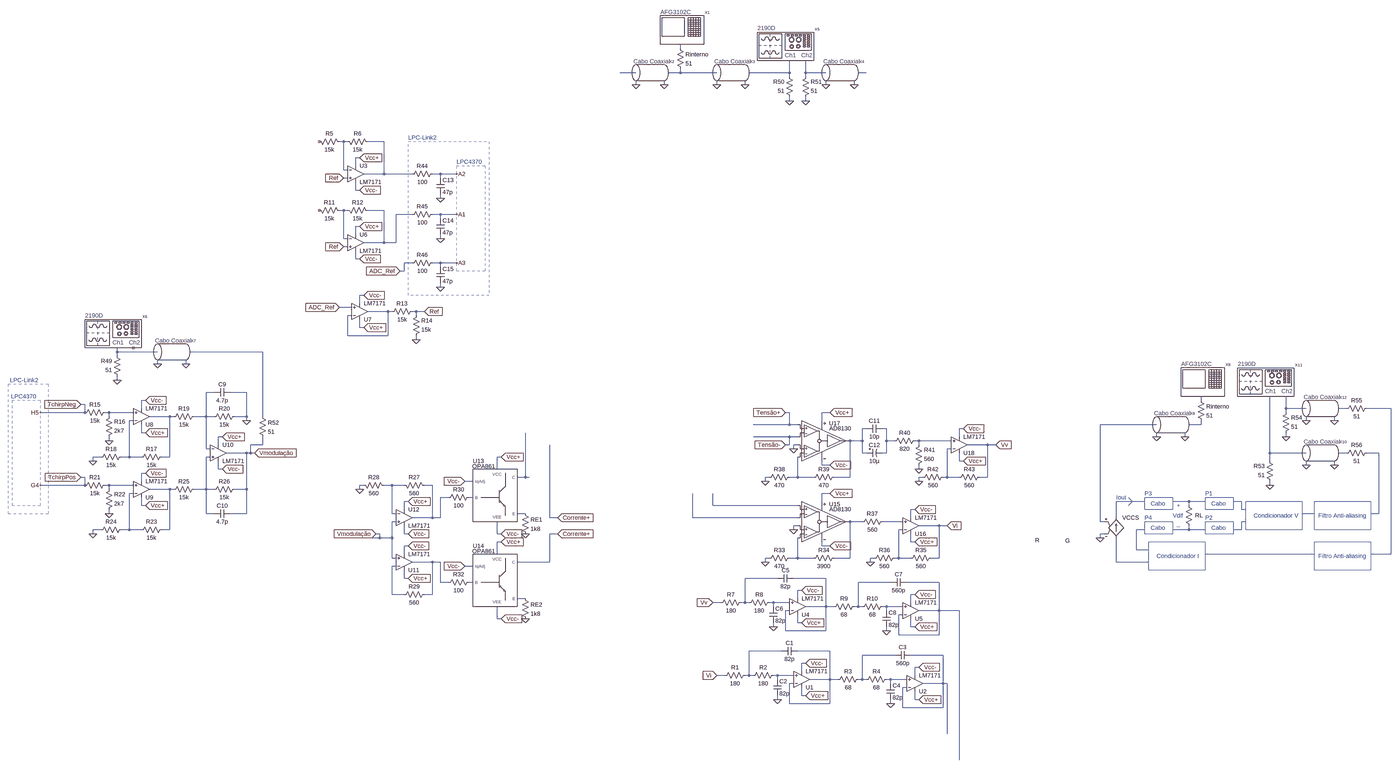
[diagram p0: schematic Circuitos de teste-atraso de grupo.asc, whole sheet]
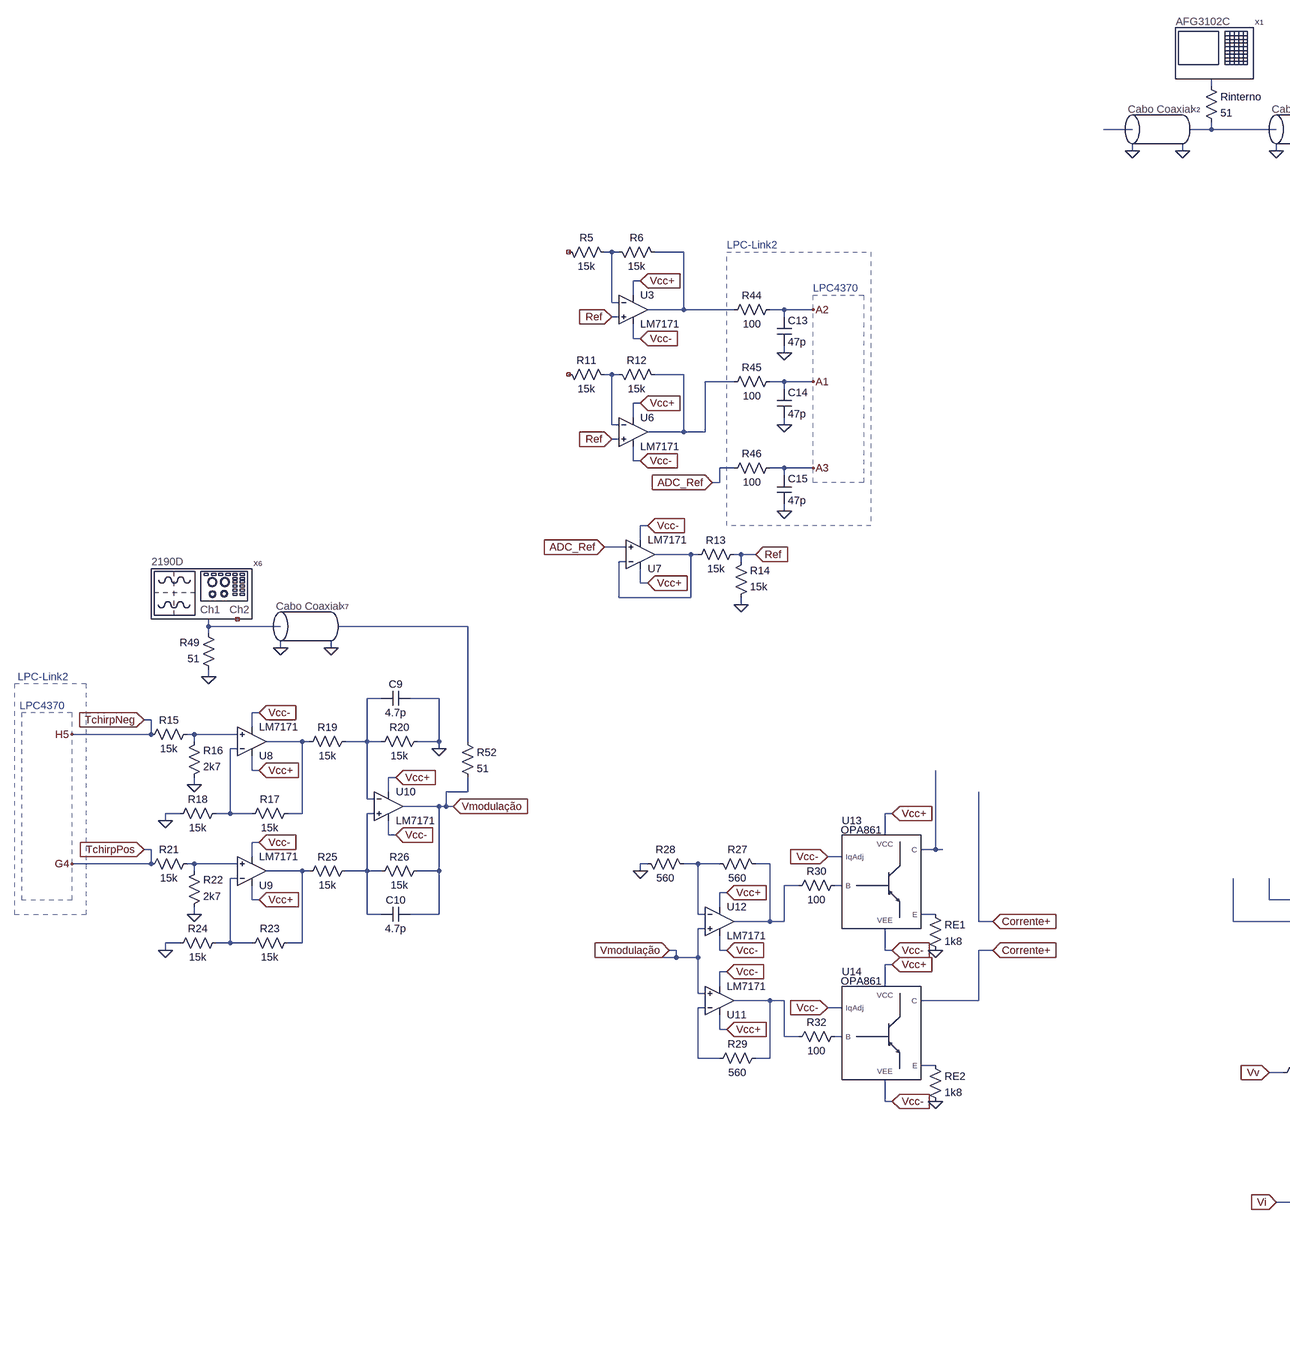
[diagram p1: schematic Circuitos de teste-atraso de grupo.asc, part, row 1 of 1, column 1 of 2]
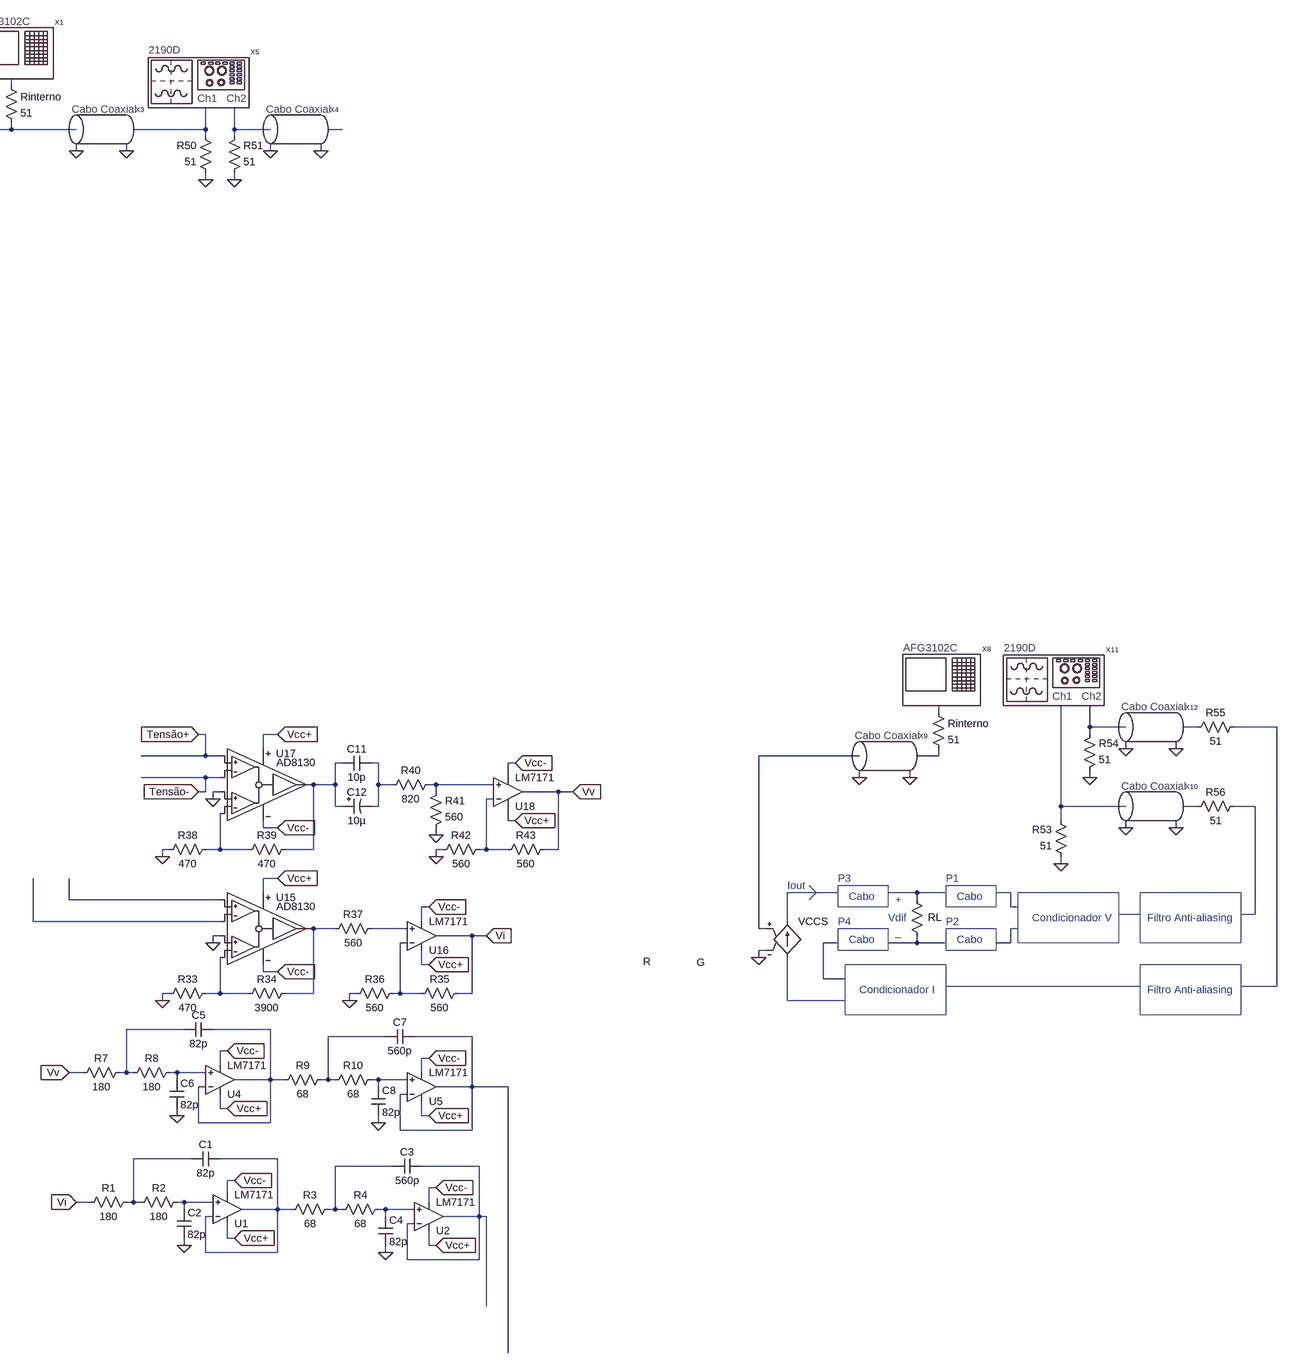
[diagram p2: schematic Circuitos de teste-atraso de grupo.asc, part, row 1 of 1, column 2 of 2]
Circuitos de teste-atraso de grupo.asc, the LTspice schematic file:
Version 4
SHEET 1 1948 1940
WIRE -1024 -1664 -1024 -1680
WIRE -1200 -1568 -1264 -1568
WIRE -1024 -1568 -1024 -1584
WIRE -1024 -1568 -1072 -1568
WIRE -880 -1568 -1024 -1568
WIRE -592 -1568 -592 -1616
WIRE -592 -1568 -752 -1568
WIRE -528 -1568 -528 -1616
WIRE -448 -1568 -528 -1568
WIRE -288 -1568 -320 -1568
WIRE -592 -1552 -592 -1568
WIRE -528 -1552 -528 -1568
WIRE -1200 -1520 -1200 -1536
WIRE -1088 -1520 -1088 -1536
WIRE -880 -1520 -880 -1536
WIRE -768 -1520 -768 -1536
WIRE -448 -1520 -448 -1536
WIRE -336 -1520 -336 -1536
WIRE -592 -1456 -592 -1472
WIRE -528 -1456 -528 -1472
WIRE -3536 -880 -3552 -880
WIRE -3520 -880 -3536 -880
WIRE -3376 -880 -3440 -880
WIRE -3472 -816 -3488 -816
WIRE -3488 -784 -3488 -816
WIRE -3536 -768 -3536 -880
WIRE -3520 -768 -3536 -768
WIRE -3376 -752 -3376 -880
WIRE -3376 -752 -3456 -752
WIRE -3264 -752 -3376 -752
WIRE -3152 -752 -3184 -752
WIRE -3088 -752 -3152 -752
WIRE -3520 -736 -3536 -736
WIRE -3152 -736 -3152 -752
WIRE -3488 -688 -3488 -720
WIRE -3472 -688 -3488 -688
WIRE -3152 -656 -3152 -672
WIRE -3536 -608 -3552 -608
WIRE -3520 -608 -3536 -608
WIRE -3376 -608 -3440 -608
WIRE -3264 -592 -3328 -592
WIRE -3152 -592 -3184 -592
WIRE -3088 -592 -3152 -592
WIRE -3152 -576 -3152 -592
WIRE -3472 -544 -3488 -544
WIRE -3488 -512 -3488 -544
WIRE -3536 -496 -3536 -608
WIRE -3520 -496 -3536 -496
WIRE -3152 -496 -3152 -512
WIRE -3376 -480 -3376 -608
WIRE -3376 -480 -3456 -480
WIRE -3328 -480 -3328 -592
WIRE -3328 -480 -3376 -480
WIRE -3520 -464 -3536 -464
WIRE -3488 -416 -3488 -448
WIRE -3472 -416 -3488 -416
WIRE -3264 -400 -3296 -400
WIRE -3152 -400 -3184 -400
WIRE -3088 -400 -3152 -400
WIRE -3152 -384 -3152 -400
WIRE -3296 -368 -3296 -400
WIRE -3296 -368 -3312 -368
WIRE -3152 -304 -3152 -320
WIRE -3456 -272 -3472 -272
WIRE -3472 -240 -3472 -272
WIRE -3504 -224 -3552 -224
WIRE -3360 -208 -3440 -208
WIRE -3344 -208 -3360 -208
WIRE -3248 -208 -3264 -208
WIRE -3216 -208 -3248 -208
WIRE -3504 -192 -3520 -192
WIRE -3248 -192 -3248 -208
WIRE -3472 -144 -3472 -176
WIRE -3456 -144 -3472 -144
WIRE -3520 -112 -3520 -192
WIRE -3360 -112 -3360 -208
WIRE -3360 -112 -3520 -112
WIRE -3248 -96 -3248 -112
WIRE -4432 -48 -4432 -64
WIRE -4272 -48 -4432 -48
WIRE -3856 -48 -4144 -48
WIRE -4432 -32 -4432 -48
WIRE -4272 0 -4272 -16
WIRE -4160 0 -4160 -16
WIRE -4432 64 -4432 48
WIRE -4048 112 -4080 112
WIRE -3920 112 -3984 112
WIRE -4320 144 -4336 144
WIRE 1104 144 1104 128
WIRE -4560 160 -4576 160
WIRE -4336 176 -4336 144
WIRE 1440 176 1440 128
WIRE 1520 176 1440 176
WIRE 1680 176 1648 176
WIRE 1856 176 1760 176
WIRE -4560 192 -4560 160
WIRE -4560 192 -4736 192
WIRE -4464 192 -4480 192
WIRE -4368 192 -4464 192
WIRE -592 192 -608 192
WIRE -432 192 -464 192
WIRE 1440 192 1440 176
WIRE -4464 208 -4464 192
WIRE -4224 208 -4304 208
WIRE -4208 208 -4224 208
WIRE -4080 208 -4080 112
WIRE -4080 208 -4128 208
WIRE -4048 208 -4080 208
WIRE -3920 208 -3920 112
WIRE -3920 208 -3968 208
WIRE -3856 208 -3856 -48
WIRE -4368 224 -4384 224
WIRE -3920 224 -3920 208
WIRE -464 224 -464 192
WIRE 1520 224 1520 208
WIRE 1632 224 1632 208
WIRE -592 240 -592 192
WIRE -592 240 -736 240
WIRE -560 240 -592 240
WIRE 928 240 704 240
WIRE 1104 240 1104 224
WIRE 1104 240 1056 240
WIRE -288 256 -304 256
WIRE -208 256 -224 256
WIRE 96 256 80 256
WIRE -4336 272 -4336 240
WIRE -4320 272 -4336 272
WIRE -4016 288 -4032 288
WIRE -592 288 -736 288
WIRE -560 288 -592 288
WIRE 80 288 80 256
WIRE 928 288 928 272
WIRE 1040 288 1040 272
WIRE 1440 288 1440 272
WIRE -4464 304 -4464 288
WIRE -304 304 -304 256
WIRE -304 304 -352 304
WIRE -208 304 -208 256
WIRE -176 304 -208 304
WIRE -80 304 -96 304
WIRE 48 304 -80 304
WIRE -4032 320 -4032 288
WIRE -3856 320 -3856 288
WIRE -3856 320 -3904 320
WIRE -592 320 -592 288
WIRE -592 320 -608 320
WIRE -560 320 -576 320
WIRE -80 320 -80 304
WIRE 192 320 112 320
WIRE 224 320 192 320
WIRE -4080 336 -4080 208
WIRE -4064 336 -4080 336
WIRE -576 336 -576 320
WIRE 48 336 32 336
WIRE -3920 352 -4000 352
WIRE -3904 352 -3904 320
WIRE -3904 352 -3920 352
WIRE -3888 352 -3904 352
WIRE -304 352 -304 304
WIRE -288 352 -304 352
WIRE -208 352 -208 304
WIRE -208 352 -224 352
WIRE 1376 352 1376 128
WIRE 1520 352 1376 352
WIRE 1680 352 1648 352
WIRE 1808 352 1760 352
WIRE -4496 368 -4528 368
WIRE -4384 368 -4384 224
WIRE -4384 368 -4416 368
WIRE -4336 368 -4384 368
WIRE -4224 368 -4224 208
WIRE -4224 368 -4256 368
WIRE -4064 368 -4080 368
WIRE -2912 368 -2928 368
WIRE -4528 384 -4528 368
WIRE 80 384 80 352
WIRE 96 384 80 384
WIRE 1376 384 1376 352
WIRE -464 400 -464 384
WIRE -432 400 -464 400
WIRE 1520 400 1520 384
WIRE 1632 400 1632 384
WIRE -4032 416 -4032 384
WIRE -4016 416 -4032 416
WIRE -2928 416 -2928 368
WIRE -80 416 -80 400
WIRE -4320 432 -4336 432
WIRE -4560 448 -4576 448
WIRE -2816 448 -2816 272
WIRE -2816 448 -2848 448
WIRE -2800 448 -2816 448
WIRE -672 448 -688 448
WIRE -560 448 -560 368
WIRE -560 448 -592 448
WIRE -496 448 -560 448
WIRE -352 448 -352 304
WIRE -352 448 -416 448
WIRE -64 448 -80 448
WIRE 32 448 32 336
WIRE 32 448 16 448
WIRE 80 448 32 448
WIRE 192 448 192 320
WIRE 192 448 160 448
WIRE -4336 464 -4336 432
WIRE -3024 464 -3056 464
WIRE -688 464 -688 448
WIRE -80 464 -80 448
WIRE -4560 480 -4560 448
WIRE -4560 480 -4736 480
WIRE -4464 480 -4480 480
WIRE -4368 480 -4464 480
WIRE -3456 480 -3472 480
WIRE -3344 480 -3376 480
WIRE -3296 480 -3344 480
WIRE -3184 480 -3216 480
WIRE 1376 480 1376 464
WIRE -4464 496 -4464 480
WIRE -4224 496 -4304 496
WIRE -4208 496 -4224 496
WIRE -4080 496 -4080 368
WIRE -4080 496 -4128 496
WIRE -4048 496 -4080 496
WIRE -3920 496 -3920 352
WIRE -3920 496 -3968 496
WIRE -3472 496 -3472 480
WIRE -4368 512 -4384 512
WIRE -432 512 -464 512
WIRE -3120 528 -3152 528
WIRE -3024 528 -3040 528
WIRE -3280 544 -3296 544
WIRE -464 544 -464 512
WIRE 880 544 768 544
WIRE 1056 544 992 544
WIRE 1120 544 1056 544
WIRE 1264 544 1232 544
WIRE -4336 560 -4336 528
WIRE -4320 560 -4336 560
WIRE -896 560 -896 512
WIRE -560 560 -896 560
WIRE 1056 560 1056 544
WIRE -3296 576 -3296 544
WIRE -96 576 -112 576
WIRE 1264 576 1264 544
WIRE 1280 576 1264 576
WIRE -4464 592 -4464 576
WIRE -4080 592 -4080 496
WIRE -4048 592 -4080 592
WIRE -3920 592 -3920 496
WIRE -3920 592 -3984 592
WIRE -3344 592 -3344 480
WIRE -3328 592 -3344 592
WIRE -2816 592 -2848 592
WIRE 1552 592 1504 592
WIRE 1808 592 1808 352
WIRE 1808 592 1776 592
WIRE -3184 608 -3184 480
WIRE -3184 608 -3264 608
WIRE -3152 608 -3152 528
WIRE -3152 608 -3184 608
WIRE -2720 608 -2720 320
WIRE -2688 608 -2720 608
WIRE -976 608 -976 512
WIRE -560 608 -976 608
WIRE -112 608 -112 576
WIRE 768 608 768 544
WIRE -3328 624 -3344 624
WIRE -304 624 -352 624
WIRE -144 624 -224 624
WIRE 704 624 704 240
WIRE 720 624 704 624
WIRE 1280 624 1264 624
WIRE -560 640 -576 640
WIRE 0 640 -80 640
WIRE 32 640 0 640
WIRE -4496 656 -4528 656
WIRE -4384 656 -4384 512
WIRE -4384 656 -4416 656
WIRE -4336 656 -4384 656
WIRE -4224 656 -4224 496
WIRE -4224 656 -4256 656
WIRE -576 656 -576 640
WIRE -144 656 -160 656
WIRE 880 656 848 656
WIRE 1056 656 1056 640
WIRE 1056 656 992 656
WIRE 1120 656 1056 656
WIRE 1264 656 1264 624
WIRE 1264 656 1232 656
WIRE -4528 672 -4528 656
WIRE -3392 672 -3408 672
WIRE -3296 672 -3296 640
WIRE -3280 672 -3296 672
WIRE -2928 672 -2928 624
WIRE -2912 672 -2928 672
WIRE -2688 672 -2720 672
WIRE 720 672 704 672
WIRE -3392 688 -3392 672
WIRE -3392 688 -3552 688
WIRE -3344 688 -3344 624
WIRE -3344 688 -3392 688
WIRE 704 688 704 672
WIRE -2912 704 -2928 704
WIRE -112 704 -112 672
WIRE -96 704 -112 704
WIRE -3280 720 -3296 720
WIRE -464 720 -464 704
WIRE -432 720 -464 720
WIRE 848 736 848 656
WIRE 896 736 848 736
WIRE -3296 752 -3296 720
WIRE -2928 752 -2928 704
WIRE 1552 752 1120 752
WIRE 1856 752 1856 176
WIRE 1856 752 1776 752
WIRE -3344 768 -3344 688
WIRE -3328 768 -3344 768
WIRE -672 768 -688 768
WIRE -560 768 -560 688
WIRE -560 768 -592 768
WIRE -496 768 -560 768
WIRE -352 768 -352 624
WIRE -352 768 -416 768
WIRE -256 768 -272 768
WIRE -160 768 -160 656
WIRE -160 768 -176 768
WIRE -112 768 -160 768
WIRE 0 768 0 640
WIRE 0 768 -32 768
WIRE -3184 784 -3264 784
WIRE -3152 784 -3184 784
WIRE -2720 784 -2720 672
WIRE -2720 784 -2848 784
WIRE -688 784 -688 768
WIRE -272 784 -272 768
WIRE 768 784 768 688
WIRE 896 784 768 784
WIRE -3328 800 -3344 800
WIRE -3024 800 -3056 800
WIRE -3296 848 -3296 816
WIRE -3280 848 -3296 848
WIRE -640 848 -768 848
WIRE -448 848 -576 848
WIRE -3152 864 -3152 784
WIRE -3120 864 -3152 864
WIRE -3024 864 -3040 864
WIRE -192 864 -320 864
WIRE 0 864 -128 864
WIRE -544 896 -560 896
WIRE -3344 912 -3344 800
WIRE -3296 912 -3344 912
WIRE -3184 912 -3184 784
WIRE -3184 912 -3216 912
WIRE -96 912 -112 912
WIRE -2816 928 -2848 928
WIRE -560 928 -560 896
WIRE -864 944 -896 944
WIRE -768 944 -768 848
WIRE -768 944 -784 944
WIRE -752 944 -768 944
WIRE -656 944 -672 944
WIRE -592 944 -656 944
WIRE -112 944 -112 912
WIRE -656 960 -656 944
WIRE -448 960 -448 848
WIRE -448 960 -528 960
WIRE -416 960 -448 960
WIRE -320 960 -320 864
WIRE -320 960 -336 960
WIRE -304 960 -320 960
WIRE -208 960 -224 960
WIRE -144 960 -208 960
WIRE -592 976 -608 976
WIRE -208 976 -208 960
WIRE 0 976 0 864
WIRE 0 976 -80 976
WIRE 80 976 0 976
WIRE -144 992 -160 992
WIRE -2928 1008 -2928 960
WIRE -2912 1008 -2928 1008
WIRE -560 1024 -560 992
WIRE -544 1024 -560 1024
WIRE -656 1040 -656 1024
WIRE -112 1040 -112 1008
WIRE -96 1040 -112 1040
WIRE -608 1056 -608 976
WIRE -448 1056 -448 960
WIRE -448 1056 -608 1056
WIRE -208 1056 -208 1040
WIRE -160 1072 -160 992
WIRE 0 1072 0 976
WIRE 0 1072 -160 1072
WIRE -624 1136 -752 1136
WIRE -432 1136 -560 1136
WIRE -176 1152 -304 1152
WIRE 16 1152 -112 1152
WIRE -528 1184 -544 1184
WIRE -80 1200 -96 1200
WIRE -544 1216 -544 1184
WIRE -848 1232 -880 1232
WIRE -752 1232 -752 1136
WIRE -752 1232 -768 1232
WIRE -736 1232 -752 1232
WIRE -640 1232 -656 1232
WIRE -576 1232 -640 1232
WIRE -96 1232 -96 1200
WIRE -640 1248 -640 1232
WIRE -432 1248 -432 1136
WIRE -432 1248 -512 1248
WIRE -400 1248 -432 1248
WIRE -304 1248 -304 1152
WIRE -304 1248 -320 1248
WIRE -288 1248 -304 1248
WIRE -192 1248 -208 1248
WIRE -128 1248 -192 1248
WIRE -576 1264 -592 1264
WIRE -192 1264 -192 1248
WIRE 16 1264 16 1152
WIRE 16 1264 -64 1264
WIRE 32 1264 16 1264
WIRE -128 1280 -144 1280
WIRE -544 1312 -544 1280
WIRE -528 1312 -544 1312
WIRE -640 1328 -640 1312
WIRE -96 1328 -96 1296
WIRE -80 1328 -96 1328
WIRE -592 1344 -592 1264
WIRE -432 1344 -432 1248
WIRE -432 1344 -592 1344
WIRE -192 1344 -192 1328
WIRE -144 1360 -144 1280
WIRE 16 1360 16 1264
WIRE 16 1360 -144 1360
WIRE 32 1616 32 1264
WIRE 80 1792 80 976
FLAG -640 1328 0
FLAG -528 1312 Vcc+
IOPIN -528 1312 In
FLAG -528 1184 Vcc-
IOPIN -528 1184 In
FLAG -192 1344 0
FLAG -80 1328 Vcc+
IOPIN -80 1328 In
FLAG -80 1200 Vcc-
IOPIN -80 1200 In
FLAG -3472 -816 Vcc+
IOPIN -3472 -816 In
FLAG -3472 -688 Vcc-
IOPIN -3472 -688 In
FLAG -656 1040 0
FLAG -544 1024 Vcc+
IOPIN -544 1024 In
FLAG -544 896 Vcc-
IOPIN -544 896 In
FLAG -208 1056 0
FLAG -96 1040 Vcc+
IOPIN -96 1040 In
FLAG -96 912 Vcc-
IOPIN -96 912 In
FLAG -3472 -544 Vcc+
IOPIN -3472 -544 In
FLAG -3472 -416 Vcc-
IOPIN -3472 -416 In
FLAG -3456 -144 Vcc+
IOPIN -3456 -144 In
FLAG -3456 -272 Vcc-
IOPIN -3456 -272 In
FLAG -3248 -96 0
FLAG -3552 -224 ADC_Ref
IOPIN -3552 -224 In
FLAG -3216 -208 Ref
IOPIN -3216 -208 In
FLAG -3536 -464 Ref
IOPIN -3536 -464 In
FLAG -3536 -736 Ref
IOPIN -3536 -736 In
FLAG -4320 272 Vcc+
IOPIN -4320 272 In
FLAG -4320 144 Vcc-
IOPIN -4320 144 In
FLAG -4464 304 0
FLAG -4320 560 Vcc+
IOPIN -4320 560 In
FLAG -4320 432 Vcc-
IOPIN -4320 432 In
FLAG -4464 592 0
FLAG -4016 288 Vcc+
IOPIN -4016 288 In
FLAG -4016 416 Vcc-
IOPIN -4016 416 In
FLAG -3920 224 0
FLAG -4576 160 TchirpNeg
IOPIN -4576 160 In
FLAG -4576 448 TchirpPos
IOPIN -4576 448 In
FLAG -4528 672 0
FLAG -4528 384 0
FLAG -3280 848 Vcc+
IOPIN -3280 848 In
FLAG -3280 720 Vcc-
IOPIN -3280 720 In
FLAG -3280 544 Vcc+
IOPIN -3280 544 In
FLAG -3280 672 Vcc-
IOPIN -3280 672 In
FLAG -3472 496 0
FLAG -2912 672 Vcc-
IOPIN -2912 672 In
FLAG -2912 368 Vcc+
IOPIN -2912 368 In
FLAG -2816 672 0
FLAG -2912 1008 Vcc-
IOPIN -2912 1008 In
FLAG -2912 704 Vcc+
IOPIN -2912 704 In
FLAG -2816 1008 0
FLAG -3056 464 Vcc-
IOPIN -3056 464 In
FLAG -3056 800 Vcc-
IOPIN -3056 800 In
FLAG -576 656 0
FLAG -688 784 0
FLAG -96 704 Vcc+
IOPIN -96 704 In
FLAG -96 576 Vcc-
IOPIN -96 576 In
FLAG -272 784 0
FLAG -432 720 Vcc-
IOPIN -432 720 In
FLAG -432 512 Vcc+
IOPIN -432 512 In
FLAG -576 336 0
FLAG -688 464 0
FLAG 96 384 Vcc+
IOPIN 96 384 In
FLAG 96 256 Vcc-
IOPIN 96 256 In
FLAG -80 464 0
FLAG -432 400 Vcc-
IOPIN -432 400 In
FLAG -432 192 Vcc+
IOPIN -432 192 In
FLAG -608 320 Tensão-
IOPIN -608 320 In
FLAG -608 192 Tensão+
IOPIN -608 192 In
FLAG -80 416 0
FLAG 32 640 Vi
IOPIN 32 640 In
FLAG 224 320 Vv
IOPIN 224 320 In
FLAG -2688 672 Corrente+
IOPIN -2688 672 In
FLAG -2688 608 Corrente+
IOPIN -2688 608 In
FLAG -3152 -656 0
FLAG -3152 -496 0
FLAG -880 1232 Vi
IOPIN -880 1232 In
FLAG -896 944 Vv
IOPIN -896 944 In
FLAG -3152 -304 0
FLAG -3312 -368 ADC_Ref
IOPIN -3312 -368 In
FLAG -3088 -752 A2
FLAG -3088 -592 A1
FLAG -3088 -400 A3
FLAG -3408 672 Vmodulação
IOPIN -3408 672 In
FLAG -3888 352 Vmodulação
IOPIN -3888 352 In
FLAG -4736 192 H5
FLAG -4736 480 G4
FLAG -1200 -1520 0
FLAG -1088 -1520 0
FLAG -880 -1520 0
FLAG -768 -1520 0
FLAG -592 -1456 0
FLAG -528 -1456 0
FLAG -448 -1520 0
FLAG -336 -1520 0
FLAG -4432 64 0
FLAG -4272 0 0
FLAG -4160 0 0
FLAG 928 288 0
FLAG 1040 288 0
FLAG 1376 480 0
FLAG 1440 288 0
FLAG 1520 224 0
FLAG 1632 224 0
FLAG 704 688 0
FLAG 1520 400 0
FLAG 1632 400 0
SYMBOL Opamps\\opamp2 -544 1312 M180
SYMATTR InstName U1
SYMATTR Value LM7171
SYMBOL res -752 1216 R90
WINDOW 0 0 56 VBottom 2
WINDOW 3 32 56 VTop 2
SYMATTR InstName R1
SYMATTR Value 180
SYMBOL res -640 1216 R90
WINDOW 0 0 56 VBottom 2
WINDOW 3 32 56 VTop 2
SYMATTR InstName R2
SYMATTR Value 180
SYMBOL cap -560 1120 R90
WINDOW 0 0 32 VBottom 2
WINDOW 3 32 32 VTop 2
SYMATTR InstName C1
SYMATTR Value 82p
SYMBOL cap -656 1248 R0
SYMATTR InstName C2
SYMATTR Value 82p
SYMBOL Opamps\\opamp2 -96 1328 M180
SYMATTR InstName U2
SYMATTR Value LM7171
SYMBOL res -304 1232 R90
WINDOW 0 0 56 VBottom 2
WINDOW 3 32 56 VTop 2
SYMATTR InstName R3
SYMATTR Value 68
SYMBOL res -192 1232 R90
WINDOW 0 0 56 VBottom 2
WINDOW 3 32 56 VTop 2
SYMATTR InstName R4
SYMATTR Value 68
SYMBOL cap -112 1136 R90
WINDOW 0 0 32 VBottom 2
WINDOW 3 32 32 VTop 2
SYMATTR InstName C3
SYMATTR Value 560p
SYMBOL cap -208 1264 R0
SYMATTR InstName C4
SYMATTR Value 82p
SYMBOL Opamps\\opamp2 -3488 -816 R0
SYMATTR InstName U3
SYMATTR Value LM7171
SYMBOL res -3536 -864 M270
WINDOW 0 32 56 VTop 2
WINDOW 3 0 56 VBottom 2
SYMATTR InstName R5
SYMATTR Value 15k
SYMBOL res -3424 -864 M270
WINDOW 0 32 56 VTop 2
WINDOW 3 0 56 VBottom 2
SYMATTR InstName R6
SYMATTR Value 15k
SYMBOL Opamps\\opamp2 -560 1024 M180
SYMATTR InstName U4
SYMATTR Value LM7171
SYMBOL res -768 928 R90
WINDOW 0 0 56 VBottom 2
WINDOW 3 32 56 VTop 2
SYMATTR InstName R7
SYMATTR Value 180
SYMBOL res -656 928 R90
WINDOW 0 0 56 VBottom 2
WINDOW 3 32 56 VTop 2
SYMATTR InstName R8
SYMATTR Value 180
SYMBOL cap -576 832 R90
WINDOW 0 0 32 VBottom 2
WINDOW 3 32 32 VTop 2
SYMATTR InstName C5
SYMATTR Value 82p
SYMBOL cap -672 960 R0
SYMATTR InstName C6
SYMATTR Value 82p
SYMBOL Opamps\\opamp2 -112 1040 M180
SYMATTR InstName U5
SYMATTR Value LM7171
SYMBOL res -320 944 R90
WINDOW 0 0 56 VBottom 2
WINDOW 3 32 56 VTop 2
SYMATTR InstName R9
SYMATTR Value 68
SYMBOL res -208 944 R90
WINDOW 0 0 56 VBottom 2
WINDOW 3 32 56 VTop 2
SYMATTR InstName R10
SYMATTR Value 68
SYMBOL cap -128 848 R90
WINDOW 0 0 32 VBottom 2
WINDOW 3 32 32 VTop 2
SYMATTR InstName C7
SYMATTR Value 560p
SYMBOL cap -224 976 R0
SYMATTR InstName C8
SYMATTR Value 82p
SYMBOL Opamps\\opamp2 -3488 -544 R0
SYMATTR InstName U6
SYMATTR Value LM7171
SYMBOL res -3536 -592 M270
WINDOW 0 32 56 VTop 2
WINDOW 3 0 56 VBottom 2
SYMATTR InstName R11
SYMATTR Value 15k
SYMBOL res -3424 -592 M270
WINDOW 0 32 56 VTop 2
WINDOW 3 0 56 VBottom 2
SYMATTR InstName R12
SYMATTR Value 15k
SYMBOL Opamps\\opamp2 -3472 -144 M180
SYMATTR InstName U7
SYMATTR Value LM7171
SYMBOL res -3248 -224 R90
WINDOW 0 0 56 VBottom 2
WINDOW 3 32 56 VTop 2
SYMATTR InstName R13
SYMATTR Value 15k
SYMBOL res -3264 -96 M180
WINDOW 0 36 76 Left 2
WINDOW 3 36 40 Left 2
SYMATTR InstName R14
SYMATTR Value 15k
SYMBOL Opamps\\opamp2 -4336 272 M180
SYMATTR InstName U8
SYMATTR Value LM7171
SYMBOL res -4464 176 R90
WINDOW 0 0 56 VBottom 2
WINDOW 3 32 56 VTop 2
SYMATTR InstName R15
SYMATTR Value 15k
SYMBOL res -4480 304 M180
WINDOW 0 36 76 Left 2
WINDOW 3 36 40 Left 2
SYMATTR InstName R16
SYMATTR Value 2k7
SYMBOL res -4240 352 R90
WINDOW 0 0 56 VBottom 2
WINDOW 3 32 56 VTop 2
SYMATTR InstName R17
SYMATTR Value 15k
SYMBOL res -4512 384 R270
WINDOW 0 32 56 VTop 2
WINDOW 3 0 56 VBottom 2
SYMATTR InstName R18
SYMATTR Value 15k
SYMBOL res -4112 192 R90
WINDOW 0 0 56 VBottom 2
WINDOW 3 32 56 VTop 2
SYMATTR InstName R19
SYMATTR Value 15k
SYMBOL res -3952 192 R90
WINDOW 0 0 56 VBottom 2
WINDOW 3 32 56 VTop 2
SYMATTR InstName R20
SYMATTR Value 15k
SYMBOL cap -3984 96 R90
WINDOW 0 0 32 VBottom 2
WINDOW 3 32 32 VTop 2
SYMATTR InstName C9
SYMATTR Value 4.7p
SYMBOL Opamps\\opamp2 -4336 560 M180
SYMATTR InstName U9
SYMATTR Value LM7171
SYMBOL res -4464 464 R90
WINDOW 0 0 56 VBottom 2
WINDOW 3 32 56 VTop 2
SYMATTR InstName R21
SYMATTR Value 15k
SYMBOL res -4480 592 M180
WINDOW 0 36 76 Left 2
WINDOW 3 36 40 Left 2
SYMATTR InstName R22
SYMATTR Value 2k7
SYMBOL res -4240 640 R90
WINDOW 0 0 56 VBottom 2
WINDOW 3 32 56 VTop 2
SYMATTR InstName R23
SYMATTR Value 15k
SYMBOL res -4512 672 R270
WINDOW 0 32 56 VTop 2
WINDOW 3 0 56 VBottom 2
SYMATTR InstName R24
SYMATTR Value 15k
SYMBOL Opamps\\opamp2 -4032 288 R0
SYMATTR InstName U10
SYMATTR Value LM7171
SYMBOL res -4112 480 R90
WINDOW 0 0 56 VBottom 2
WINDOW 3 32 56 VTop 2
SYMATTR InstName R25
SYMATTR Value 15k
SYMBOL res -3952 480 R90
WINDOW 0 0 56 VBottom 2
WINDOW 3 32 56 VTop 2
SYMATTR InstName R26
SYMATTR Value 15k
SYMBOL cap -3984 576 R90
WINDOW 0 0 32 VBottom 2
WINDOW 3 32 32 VTop 2
SYMATTR InstName C10
SYMATTR Value 4.7p
SYMBOL Opamps\\opamp2 -3296 848 M180
SYMATTR InstName U11
SYMATTR Value LM7171
SYMBOL res -3200 896 R90
WINDOW 0 0 56 VBottom 2
WINDOW 3 32 56 VTop 2
SYMATTR InstName R29
SYMATTR Value 560
SYMBOL Opamps\\opamp2 -3296 544 R0
SYMATTR InstName U12
SYMATTR Value LM7171
SYMBOL res -3200 496 M270
WINDOW 0 32 56 VTop 2
WINDOW 3 0 56 VBottom 2
SYMATTR InstName R27
SYMATTR Value 560
SYMBOL res -3360 496 M270
WINDOW 0 32 56 VTop 2
WINDOW 3 0 56 VBottom 2
SYMATTR InstName R28
SYMATTR Value 560
SYMBOL opa681 -2960 560 R0
SYMATTR InstName U13
SYMBOL res -2832 576 R0
SYMATTR InstName RE1
SYMATTR Value 1k8
SYMBOL res -3024 512 R90
WINDOW 0 0 56 VBottom 2
WINDOW 3 32 56 VTop 2
SYMATTR InstName R30
SYMATTR Value 100
SYMBOL opa681 -2960 896 R0
SYMATTR InstName U14
SYMBOL res -2832 912 R0
SYMATTR InstName RE2
SYMATTR Value 1k8
SYMBOL res -3024 848 R90
WINDOW 0 0 56 VBottom 2
WINDOW 3 32 56 VTop 2
SYMATTR InstName R32
SYMATTR Value 100
SYMBOL ad8130 -480 624 R0
SYMATTR InstName U15
SYMBOL res -576 752 R90
WINDOW 0 0 56 VBottom 2
WINDOW 3 32 56 VTop 2
SYMATTR InstName R33
SYMATTR Value 470
SYMBOL res -400 752 R90
WINDOW 0 0 56 VBottom 2
WINDOW 3 32 56 VTop 2
SYMATTR InstName R34
SYMATTR Value 3900
SYMBOL res -208 608 R90
WINDOW 0 0 56 VBottom 2
WINDOW 3 32 56 VTop 2
SYMATTR InstName R37
SYMATTR Value 560
SYMBOL Opamps\\opamp2 -112 704 M180
SYMATTR InstName U16
SYMATTR Value LM7171
SYMBOL res -16 752 R90
WINDOW 0 0 56 VBottom 2
WINDOW 3 32 56 VTop 2
SYMATTR InstName R35
SYMATTR Value 560
SYMBOL res -160 752 R90
WINDOW 0 0 56 VBottom 2
WINDOW 3 32 56 VTop 2
SYMATTR InstName R36
SYMATTR Value 560
SYMBOL ad8130 -480 304 R0
SYMATTR InstName U17
SYMBOL res -576 432 R90
WINDOW 0 0 56 VBottom 2
WINDOW 3 32 56 VTop 2
SYMATTR InstName R38
SYMATTR Value 470
SYMBOL res -400 432 R90
WINDOW 0 0 56 VBottom 2
WINDOW 3 32 56 VTop 2
SYMATTR InstName R39
SYMATTR Value 470
SYMBOL res -80 288 R90
WINDOW 0 0 56 VBottom 2
WINDOW 3 32 56 VTop 2
SYMATTR InstName R40
SYMATTR Value 820
SYMBOL Opamps\\opamp2 80 384 M180
SYMATTR InstName U18
SYMATTR Value LM7171
SYMBOL res 176 432 R90
WINDOW 0 0 56 VBottom 2
WINDOW 3 32 56 VTop 2
SYMATTR InstName R43
SYMATTR Value 560
SYMBOL res 32 432 R90
WINDOW 0 0 56 VBottom 2
WINDOW 3 32 56 VTop 2
SYMATTR InstName R42
SYMATTR Value 560
SYMBOL cap -224 240 R90
WINDOW 0 0 32 VBottom 2
WINDOW 3 32 32 VTop 2
SYMATTR InstName C11
SYMATTR Value 10p
SYMBOL polcap -288 336 M90
WINDOW 0 0 32 VBottom 2
WINDOW 3 32 32 VTop 2
SYMATTR InstName C12
SYMATTR Value 10µ
SYMATTR Description Capacitor
SYMATTR Type cap
SYMATTR SpiceLine V=4 Irms=3.72678 Rser=0.018 Lser=0 mfg="KEMET" pn="A700D107M004ATE018" type="Al electrolytic"
SYMBOL res -96 416 M180
WINDOW 0 36 76 Left 2
WINDOW 3 36 40 Left 2
SYMATTR InstName R41
SYMATTR Value 560
SYMBOL res -3168 -768 R90
WINDOW 0 0 56 VBottom 2
WINDOW 3 32 56 VTop 2
SYMATTR InstName R44
SYMATTR Value 100
SYMBOL cap -3168 -736 R0
SYMATTR InstName C13
SYMATTR Value 47p
SYMBOL res -3168 -608 R90
WINDOW 0 0 56 VBottom 2
WINDOW 3 32 56 VTop 2
SYMATTR InstName R45
SYMATTR Value 100
SYMBOL cap -3168 -576 R0
SYMATTR InstName C14
SYMATTR Value 47p
SYMBOL res -3168 -416 R90
WINDOW 0 0 56 VBottom 2
WINDOW 3 32 56 VTop 2
SYMATTR InstName R46
SYMATTR Value 100
SYMBOL cap -3168 -384 R0
SYMATTR InstName C15
SYMATTR Value 47p
SYMBOL afg3102c -1104 -1680 R0
SYMATTR InstName X1
SYMBOL coaxialCable -1216 -1536 R0
SYMATTR InstName X2
SYMBOL res -1040 -1680 R0
SYMATTR InstName Rinterno
SYMATTR Value 51
SYMBOL coaxialCable -896 -1536 R0
SYMATTR InstName X3
SYMBOL osc -720 -1616 R0
SYMATTR InstName X5
SYMBOL res -576 -1456 R180
WINDOW 0 36 76 Left 2
WINDOW 3 36 40 Left 2
SYMATTR InstName R50
SYMATTR Value 51
SYMBOL res -544 -1456 M180
WINDOW 0 36 76 Left 2
WINDOW 3 36 40 Left 2
SYMATTR InstName R51
SYMATTR Value 51
SYMBOL coaxialCable -464 -1536 R0
SYMATTR InstName X4
SYMBOL osc -4560 -64 R0
SYMATTR InstName X6
SYMBOL res -4416 64 R180
WINDOW 0 36 76 Left 2
WINDOW 3 36 40 Left 2
SYMATTR InstName R49
SYMATTR Value 51
SYMBOL coaxialCable -4288 -16 R0
SYMATTR InstName X7
SYMBOL res -3872 192 R0
SYMATTR InstName R52
SYMATTR Value 51
SYMBOL afg3102c 1024 128 R0
SYMATTR InstName X8
SYMBOL coaxialCable 912 272 R0
SYMATTR InstName X9
SYMBOL res 1088 128 R0
SYMATTR InstName Rinterno
SYMATTR Value 51
SYMBOL osc 1248 128 R0
SYMATTR InstName X11
SYMBOL res 1392 480 R180
WINDOW 0 36 76 Left 2
WINDOW 3 36 40 Left 2
SYMATTR InstName R53
SYMATTR Value 51
SYMBOL res 1424 288 M180
WINDOW 0 36 76 Left 2
WINDOW 3 36 40 Left 2
SYMATTR InstName R54
SYMATTR Value 51
SYMBOL coaxialCable 1504 208 R0
SYMATTR InstName X12
SYMBOL res 1776 160 R90
WINDOW 0 0 56 VBottom 2
WINDOW 3 32 56 VTop 2
SYMATTR InstName R55
SYMATTR Value 51
SYMBOL g 768 592 R0
WINDOW 3 -235 107 Left 2
SYMATTR InstName VCCS
SYMBOL res 1040 544 R0
WINDOW 3 -660 153 Left 2
WINDOW 0 40 55 Left 2
SYMATTR InstName RL
SYMBOL coaxialCable 1504 384 R0
SYMATTR InstName X10
SYMBOL res 1776 336 R90
WINDOW 0 0 56 VBottom 2
WINDOW 3 32 56 VTop 2
SYMATTR InstName R56
SYMATTR Value 51
TEXT -3280 -896 Left 2 ;LPC-Link2
TEXT -3088 -800 Left 2 ;LPC4370
TEXT -4744 64 Right 2 ;LPC-Link2
TEXT -4752 128 Right 2 ;LPC4370
TEXT 768 528 Left 2 ;Iout
TEXT 992 600 Left 2 ;Vdif
TEXT 1008 560 Left 2 ;+
TEXT 1008 632 Left 2 ;_
TEXT 1312 600 Left 2 ;Condicionador V
TEXT 928 760 Left 2 ;Condicionador I
TEXT 1568 600 Left 2 ;Filtro Anti-aliasing
TEXT 1568 760 Left 2 ;Filtro Anti-aliasing
TEXT 904 552 Left 2 ;Cabo
TEXT 880 512 Left 2 ;P3
TEXT 904 648 Left 2 ;Cabo
TEXT 880 608 Left 2 ;P4
TEXT 1144 552 Left 2 ;Cabo
TEXT 1120 512 Left 2 ;P1
TEXT 1144 648 Left 2 ;Cabo
TEXT 1120 608 Left 2 ;P2
LINE Normal 816 528 832 544
LINE Normal 832 544 816 528 2
LINE Normal 832 544 832 544 2
LINE Normal 816 560 832 544
RECTANGLE Normal -2960 -272 -3280 -880 2
RECTANGLE Normal -2976 -368 -3088 -784 2
RECTANGLE Normal -4864 592 -4704 80 2
RECTANGLE Normal -4848 560 -4736 144 2
RECTANGLE Normal 1504 656 1280 544
RECTANGLE Normal 1120 816 896 704
RECTANGLE Normal 1776 656 1552 544
RECTANGLE Normal 1776 816 1552 704
RECTANGLE Normal 992 576 880 528
RECTANGLE Normal 992 672 880 624
RECTANGLE Normal 1232 576 1120 528
RECTANGLE Normal 1232 672 1120 624

The netlist it stands for:
* Circuitos de teste-atraso de grupo.asc
XU1 N070 N067 Vcc+ Vcc- N067 LM7171  ; pins In+ In- V+ V- OUT
R1 N066 Vi 180
R2 N070 N066 180
C1 N067 N066 82p
C2 N070 0 82p
XU2 N071 N069 Vcc+ Vcc- N069 LM7171  ; pins In+ In- V+ V- OUT
R3 N068 N067 68
R4 N071 N068 68
C3 N069 N068 560p
C4 N071 0 82p
XU3 Ref N007 Vcc+ Vcc- N008 LM7171  ; pins In+ In- V+ V- OUT
R5 N007 NC_01 15k
R6 N008 N007 15k
XU4 N064 N059 Vcc+ Vcc- N059 LM7171  ; pins In+ In- V+ V- OUT
R7 N058 Vv 180
R8 N064 N058 180
C5 N059 N058 82p
C6 N064 0 82p
XU5 N065 N062 Vcc+ Vcc- N062 LM7171  ; pins In+ In- V+ V- OUT
R9 N061 N059 68
R10 N065 N061 68
C7 N062 N061 560p
C8 N065 0 82p
XU6 Ref N009 Vcc+ Vcc- N010 LM7171  ; pins In+ In- V+ V- OUT
R11 N009 NC_02 15k
R12 N010 N009 15k
XU7 ADC_Ref N011 Vcc+ Vcc- N011 LM7171  ; pins In+ In- V+ V- OUT
R13 Ref N011 15k
R14 0 Ref 15k
XU8 N019 N021 Vcc+ Vcc- N020 LM7171  ; pins In+ In- V+ V- OUT
R15 N019 H5 15k
R16 0 N019 2k7
R17 N020 N021 15k
R18 0 N021 15k
R19 N014 N020 15k
R20 0 N014 15k
C9 0 N014 4.7p
XU9 N034 N038 Vcc+ Vcc- N037 LM7171  ; pins In+ In- V+ V- OUT
R21 N034 G4 15k
R22 0 N034 2k7
R23 N037 N038 15k
R24 0 N038 15k
XU10 N031 N014 Vcc+ Vcc- Vmodulação LM7171  ; pins In+ In- V+ V- OUT
R25 N031 N037 15k
R26 Vmodulação N031 15k
C10 Vmodulação N031 4.7p
XU11 Vmodulação N057 Vcc+ Vcc- N055 LM7171  ; pins In+ In- V+ V- OUT
R29 N055 N057 560
XU12 Vmodulação N035 Vcc+ Vcc- N036 LM7171  ; pins In+ In- V+ V- OUT
R27 N036 N035 560
R28 N035 0 560
XU13 N039 N032 N044 Vcc- Vcc+ Vcc- OPA861  ; pins B C E IqAdj VCC VEE
RE1 N044 0 1k8
R30 N039 N036 100
XU14 N060 Corrente+ N063 Vcc- Vcc+ Vcc- OPA861  ; pins B C E IqAdj VCC VEE
RE2 N063 0 1k8
R32 N060 N055 100
XU15 N043 N046 0 N054 Vcc+ Vcc- N047 AD8130  ; pins 1 2 3 4 99 50 45
R33 N054 0 470
R34 N047 N054 3900
R37 N048 N047 560
XU16 N048 N050 Vcc+ Vcc- Vi LM7171  ; pins In+ In- V+ V- OUT
R35 Vi N050 560
R36 N050 0 560
XU17 Tensão+ Tensão- 0 N033 Vcc+ Vcc- N024 AD8130  ; pins 1 2 3 4 99 50 45
R38 N033 0 470
R39 N024 N033 470
R40 N026 N025 820
XU18 N026 N027 Vcc+ Vcc- Vv LM7171  ; pins In+ In- V+ V- OUT
R43 Vv N027 560
R42 N027 0 560
C11 N025 N024 10p
C12 N024 N025 10µ V=4 Irms=3.72678 Rser=0.018 Lser=0 mfg="KEMET" pn="A700D107M004ATE018" type="Al electrolytic"
R41 0 N026 560
R44 A2 N008 100
C13 A2 0 47p
R45 A1 N010 100
C14 A1 0 47p
R46 A3 ADC_Ref 100
C15 A3 0 47p
XX1 N001 afg3102c
XX2 N002 0 0 N003 coaxialCable
Rinterno N001 N003 51
XX3 N003 0 0 N004 coaxialCable
XX5 N004 N005 osc
R50 0 N004 51
R51 0 N005 51
XX4 N005 0 0 N006 coaxialCable
XX6 N012 NC_03 osc
R49 0 N012 51
XX7 N012 0 0 N013 coaxialCable
R52 N013 Vmodulação 51
XX8 N015 afg3102c
XX9 N022 0 0 N023 coaxialCable
Rinterno N015 N023 51
XX11 N028 N016 osc
R53 0 N028 51
R54 0 N016 51
XX12 N016 0 0 N017 coaxialCable
R55 N018 N017 51
G§VCCS N056 N040 N022 0 G
RL N041 N052 R
XX10 N028 0 0 N029 coaxialCable
R56 N030 N029 51
* LPC-Link2
* LPC4370
* LPC-Link2
* LPC4370
* Iout
* Vdif
* +
* _
* Condicionador V
* Condicionador I
* Filtro Anti-aliasing
* Filtro Anti-aliasing
* Cabo
* P3
* Cabo
* P4
* Cabo
* P1
* Cabo
* P2
.lib .\OPA861Model.sub
.lib .\ad8130.cir
.backanno
.end